# Altium schematic sheet BLE_controller.SchDoc
size A4
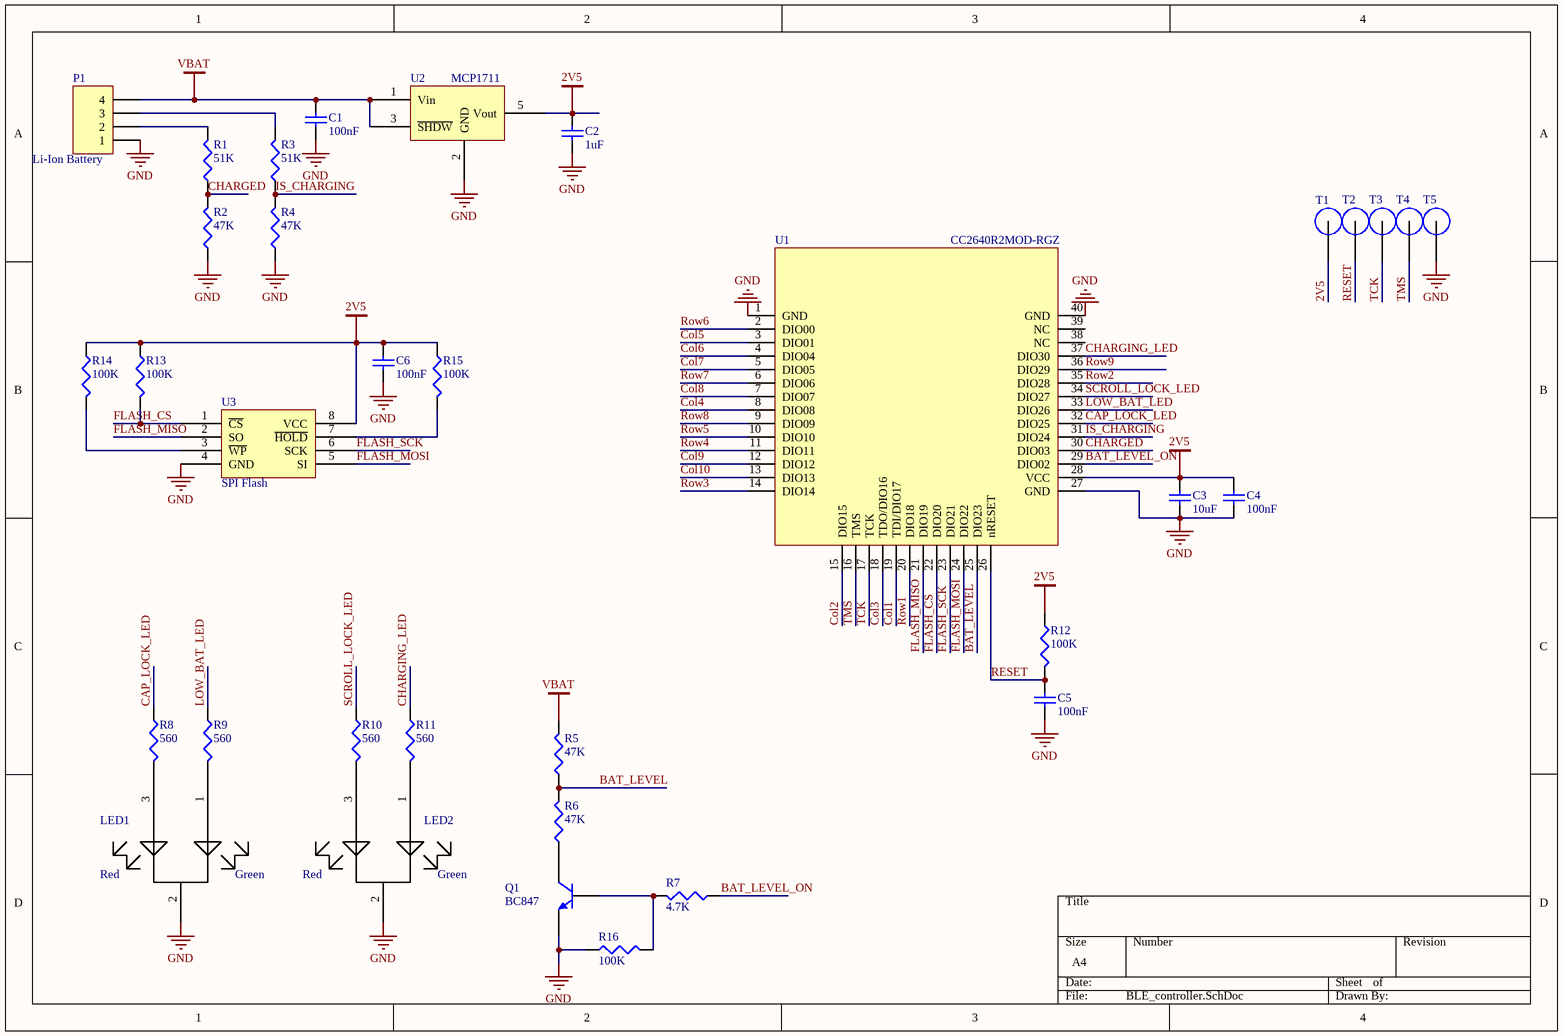
[diagram p0: BLE_controller.SchDoc]

## Parts
C1  value 100nF  [C805_4MOD]  (hidden comment: Cap Semi)
C2  value 1uF  [C805_4MOD]  (hidden comment: Cap Semi)
C3  value 10uF  [C805_4MOD]  (hidden comment: Cap Semi)
C4  value 100nF  [C805_4MOD]  (hidden comment: Cap Semi)
C5  value 100nF  [C805_4MOD]  (hidden comment: Cap Semi)
C6  value 100nF  [C805_4MOD]  (hidden comment: Cap Semi)
LED1  Doule_LED_Common_Negative  [Double_LED_Common_Negative]  (value not drawn)
LED2  Doule_LED_Common_Negative  [Double_LED_Common_Negative]  (value not drawn)
P1  Li-Ion Battery  [HDR1X4]
Q1  BC847  [SOT23-3]
R1  value 51K  [R805_4MOD]  (hidden comment: Res3)
R2  value 47K  [R805_4MOD]  (hidden comment: Res3)
R3  value 51K  [R805_4MOD]  (hidden comment: Res3)
R4  value 47K  [R805_4MOD]  (hidden comment: Res3)
R5  value 47K  [R805_4MOD]  (hidden comment: Res3)
R6  value 47K  [R805_4MOD]  (hidden comment: Res3)
R7  value 4.7K  [R805_4MOD]  (hidden comment: Res3)
R8  value 560  [R805_4MOD]  (hidden comment: Res3)
R9  value 560  [R805_4MOD]  (hidden comment: Res3)
R10  value 560  [R805_4MOD]  (hidden comment: Res3)
R11  value 560  [R805_4MOD]  (hidden comment: Res3)
R12  value 100K  [R805_4MOD]  (hidden comment: Res3)
R13  value 100K  [R805_4MOD]  (hidden comment: Res3)
R14  value 100K  [R805_4MOD]  (hidden comment: Res3)
R15  value 100K  [R805_4MOD]  (hidden comment: Res3)
R16  value 100K  [R805_4MOD]  (hidden comment: Res3)
T1  Test_Point  [Test_Point]  (value not drawn)
T2  Test_Point  [Test_Point]  (value not drawn)
T3  Test_Point  [Test_Point]  (value not drawn)
T4  Test_Point  [Test_Point]  (value not drawn)
T5  Test_Point  [Test_Point]  (value not drawn)
U1  CC2640R2MOD-RGZ  [CC26XXMOD-RGZ]
U2  MCP1711  [LC-SOT-23-5]
U3  SPI Flash  [LC-SOIC-8_150mil]

## Nets
2V5: C2.2 C3.2 C4.2 C6.2 R12.1 R13.1 R14.1 R15.1 T1.1 U1.28(VCC) U2.5(Vout) U3.8(VCC)
GND: C1.1 C2.1 C3.1 C4.1 C5.1 C6.1 LED1.2 LED2.2 P1.1 Q1.2(E) R2.1 R4.1 R16.1 T5.1 U1.1(GND) U1.27(GND) U1.40(GND) U2.2(GND) U3.4(GND)
VBAT: C1.2 P1.4 R5.2 U2.1(Vin) U2.3(~{SHDW})
BAT_LEVEL: R5.1 R6.2 U1.25(DIO23)
BAT_LEVEL_ON: R7.1 U1.29(DIO02)
CAP_LOCK_LED: R8.1 U1.32(DIO25)
CHARGED: R1.1 R2.2 U1.30(DIO03)
CHARGING_LED: R11.1 U1.37(DIO30)
Col1: U1.19(TDI/DIO17)
Col2: U1.15(DIO15)
Col3: U1.18(TDO/DIO16)
Col4: U1.8(DIO08)
Col5: U1.3(DIO01)
Col6: U1.4(DIO04)
Col7: U1.5(DIO05)
Col8: U1.7(DIO07)
Col9: U1.12(DIO12)
Col10: U1.13(DIO13)
FLASH_CS: R13.2 U1.22(DIO20) U3.1(~{CS})
FLASH_MISO: U1.21(DIO19) U3.2(SO)
FLASH_MOSI: U1.24(DIO22) U3.5(SI)
FLASH_SCK: U1.23(DIO21) U3.6(SCK)
IS_CHARGING: R3.1 R4.2 U1.31(DIO24)
LOW_BAT_LED: R9.1 U1.33(DIO26)
RESET: C5.2 R12.2 T2.1 U1.26(nRESET)
Row1: U1.20(DIO18)
Row2: U1.35(DIO28)
Row3: U1.14(DIO14)
Row4: U1.11(DIO11)
Row5: U1.10(DIO10)
Row6: U1.2(DIO00)
Row7: U1.6(DIO06)
Row8: U1.9(DIO09)
Row9: U1.36(DIO29)
SCROLL_LOCK_LED: R10.1 U1.34(DIO27)
TCK: T3.1 U1.17(TCK)
TMS: T4.1 U1.16(TMS)
NetLED1_1: LED1.1 R9.2
NetLED1_3: LED1.3 R8.2
NetLED2_1: LED2.1 R11.2
NetLED2_3: LED2.3 R10.2
NetP1_2: P1.2 R1.2
NetP1_3: P1.3 R3.2
NetQ1_1: Q1.1(B) R7.2 R16.2
NetQ1_3: Q1.3(C) R6.1
NetR14_2: R14.2 U3.3(~{WP})
NetR15_2: R15.2 U3.7(~{HOLD})

Not connected (* = marked no-connect by the designer): U1 38(NC) 39(NC)

## Notes on the sheet
- (in symbol Doule_LED_Common_Negative) Red; Green

## Library data of the parts
C1-C6 = Cap Semi: Capacitor (Semiconductor SIM Model); Published: 8-Jun-2000; LatestRevisionDate: 29-May-2009; LatestRevisionNote: IPC-7351 Footprint Added.; PackageReference: C0805; Publisher: Altium Limited; PackageDescription: Chip Capacitor
LED1 = Doule_LED_Common_Negative: 209SURSYGW/S530-A3
P1 = Header 4: Header, 4-Pin; LatestRevisionDate: 17-Jul-2002; LatestRevisionNote: Re-released for DXP Platform.; Publisher: Altium Limited
Q1 = 2N3904: NPN General Purpose Amplifier; Published: 8-Jun-2000; LatestRevisionDate: 15-Jan-2003; LatestRevisionNote: PCB Footprint 'BCY-W3/D4.7' replaced; DatasheetVersion: 1997; PackageVersion: Sep-1998; PackageReference: TO-92A; Publisher: Altium Limited; PackageDescription: TO, Flat Index; 3 In-Line, Axial Leads; Body Dia. 4.5mm; Leads 0.51 x 0.48 mm (max); ComponentLink1Description: Manufacturer Link; ComponentLink1URL: http://www.fairchildsemi.com/; ComponentLink2Description: Datasheet; ComponentLink2URL: http://www.fairchildsemi.com/ds/2N%2F2N3904.pdf
R1-R16 = Res3: Resistor; Published: 8-Jun-2000; LatestRevisionDate: 29-May-2009; LatestRevisionNote: IPC-7351 Footprint Added.; PackageReference: J1-0603; Publisher: Altium Limited; PackageDescription: Chip Resistor
U1 = CC26XXMOD-RGZ: Ghostyu CC26XX  Module; Part Number: CC26XXMOD-RGZ; Manufacturer: Ghostyu; Part Value: CC2640R2MOD-RGZ
U3 = AT25XE021A_SOIC-8